# Altium schematic sheet Key.SchDoc
size A4
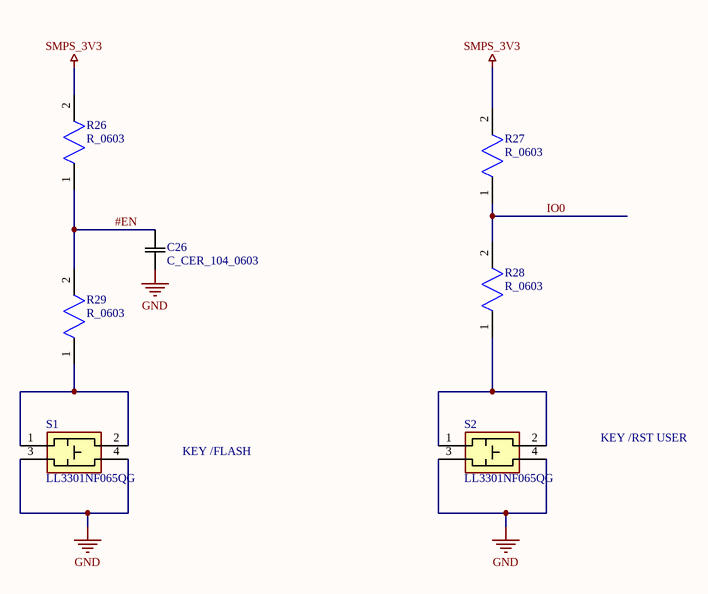
[diagram p0: Key.SchDoc]

## Parts
C26  C_CER_104_0603  [G-188_MUR]
R26  R_0603
R27  R_0603
R28  R_0603
R29  R_0603
S1  LL3301NF065QG  [LL3301NF065QG]
S2  LL3301NF065QG  [LL3301NF065QG]

## Nets
GND: C26.1 S1.3 S1.4 S2.3 S2.4
SMPS_3V3: R26.2 R27.2
#EN: C26.2 R26.1 R29.2
IO0: R27.1 R28.2
NetR28_1: R28.1 S2.1 S2.2
NetR29_1: R29.1 S1.1 S1.2

## Notes on the sheet
- KEY /RST USER
- KEY /FLASH

## Library data of the parts
C26 = C_CER_226_0603: Manufacturer_Part_Number: GRM188R60J226MEA0D; Vendor: Murata; SourceLibrary: Murata_2014-12-31; Type: DEV; Copyright: Copyright (C) 2015 Accelerated Designs. All rights reserved; RefDes: RefDes
R26-R29 = R_0603: Resistor; Manufacturer_Name: Vishay; Manufacturer_Part_Number: CRCW0402100KFKED; Datasheet Link: http://www.vishay.com/docs/20035/dcrcwe3.pdf; Height: 0.4mm
S1 S2 = LL3301NF065QG: Switch; Manufacturer_Name: E-Switch; Datasheet Link: https://componentsearchengine.com//LL3301NF065QG.pdf; Height: 4mm; Mouser2 Part Number: 612-LL3301NF065QG; Mouser2 Price/Stock: https://www.mouser.com/Search/Refine.aspx?Keyword=612-LL3301NF065QG; Manufacturer_Part_Number: LL3301NF065QG